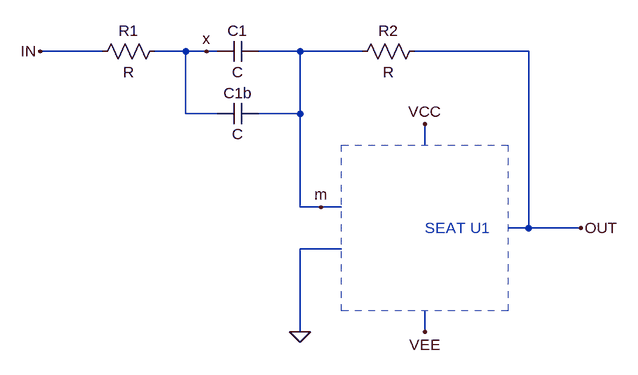
[diagram p0: schematic FO_HP_inv.asc]
FO_HP_inv.asc, the LTspice schematic file:
Version 4.1
SHEET 1 1096 680
WIRE 176 -64 80 -64
WIRE 304 -64 256 -64
WIRE 336 -64 304 -64
WIRE 352 -64 336 -64
WIRE 480 -64 416 -64
WIRE 576 -64 480 -64
WIRE 832 -64 656 -64
WIRE 304 32 304 -64
WIRE 352 32 304 32
WIRE 480 32 480 -64
WIRE 480 32 416 32
WIRE 672 80 672 48
WIRE 480 176 480 32
WIRE 512 176 480 176
WIRE 544 176 512 176
WIRE 832 208 832 -64
WIRE 832 208 800 208
WIRE 912 208 832 208
WIRE 544 240 480 240
WIRE 480 368 480 240
WIRE 672 368 672 336
FLAG 912 208 OUT
FLAG 672 48 VCC
FLAG 672 368 VEE
FLAG 512 176 m
FLAG 80 -64 IN
FLAG 480 368 0
FLAG 336 -64 x
SYMBOL res 272 -80 R90
WINDOW 0 0 56 VBottom 2
WINDOW 3 32 56 VTop 2
SYMATTR InstName R1
SYMBOL res 672 -80 R90
WINDOW 0 0 56 VBottom 2
WINDOW 3 32 56 VTop 2
SYMATTR InstName R2
SYMBOL cap 416 16 R90
WINDOW 3 32 32 VTop 2
WINDOW 0 0 32 VBottom 2
SYMATTR InstName C1b
SYMBOL cap 416 -80 R90
WINDOW 0 0 32 VBottom 2
WINDOW 3 32 32 VTop 2
SYMATTR InstName C1
TEXT 672 208 Left 2 ;SEAT U1
RECTANGLE Normal 544 80 800 336 2

The netlist it stands for:
* FO_HP_inv.asc
R1 x IN R
R2 OUT m R
C1b m x C
C1 m x C
* SEAT U1
.backanno
.end